# EAGLE design untitled-pan (EAGLE 6.4)
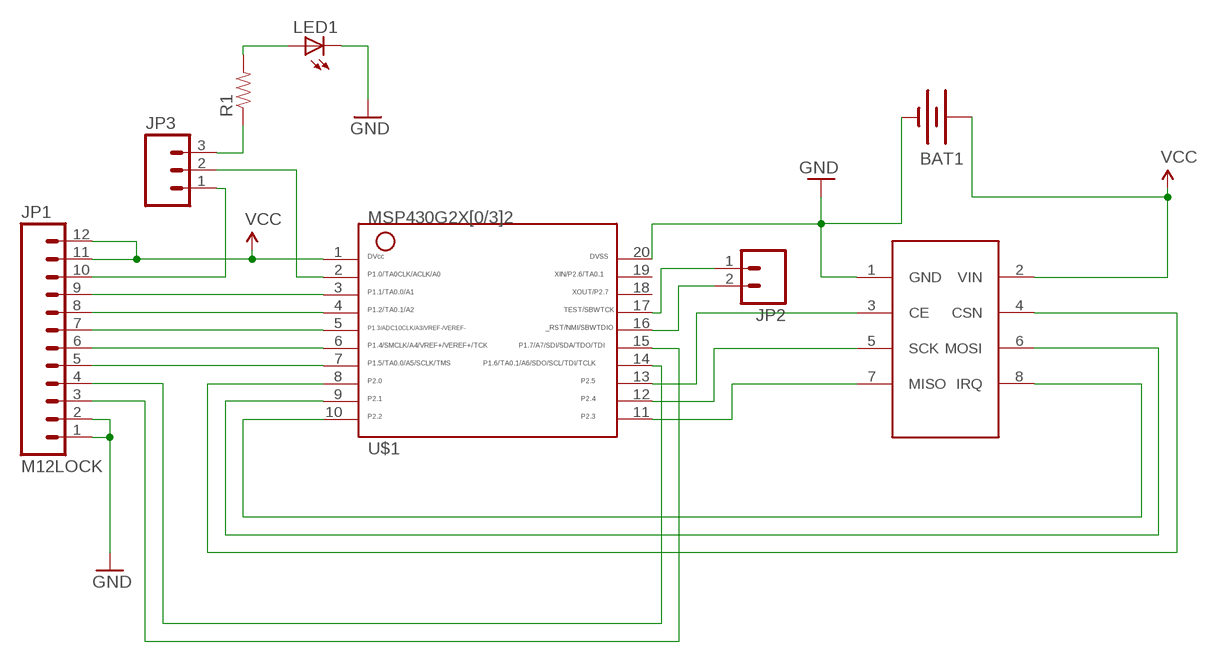
[diagram p0: schematic, sheet 1]

## Parts
BAT1  BATTERY20PTH  [BATTCOM_20MM_PTH]
JP1  M12LOCK  [1X12_LOCK]
JP2  M02PTH  [1X02]
JP3  M03PTH  [1X03]
LED1  LED3MM  [LED3MM]
R1  RESISTORAXIAL-0.3  [AXIAL-0.3]
U1  NRF24L01-4X2  [NRF24L01-4X2]
U$1  G2X[0/3]2---N20  [N20]

## Nets
GND: BAT1.2(-) JP1.1 JP1.2 LED1.K(C) U1.1(GND) U$1.20
N$1: U1.3(CE) U$1.13
N$2: U1.8(IRQ) U$1.10
N$3: U1.7(MISO) U$1.11
N$4: U1.5(SCK) U$1.12
N$5: JP1.4 U$1.14
N$6: JP1.3 U$1.15
N$7: JP1.6 U$1.6
N$8: JP1.7 U$1.5
N$9: JP1.8 U$1.4
N$10: JP1.9 U$1.3
N$11: JP3.2 U$1.2
N$12: JP1.5 U$1.7
N$13: JP2.2 U$1.16
N$14: JP2.1 U$1.17
N$15: JP3.3 R1.P$1
N$16: JP1.10 JP3.1
N$17: U1.6(MOSI) U$1.9
N$18: U1.4(CSN) U$1.8
N$19: LED1.A R1.P$2
VCC: BAT1.1(+) JP1.11 JP1.12 U1.2(VIN) U$1.1
Unconnected: U$1.18 U$1.19

## Library data of the parts
BAT1 = SparkFun-Electromechanical:BATTERY: Battery Holders Various common sizes : AA, AAA, 20mm coin cell and 12mm coin cell. 20MM_4LEGS, BATT-10373
JP1 = SparkFun-Connectors:M12: Header 12 Standard 12-pin 0.1" header. Use with straight break away headers (SKU : PRT-00116), right angle break away headers (PRT-00553), swiss pins (PRT-00743), machine pins (PRT-00117), and female headers (PRT-00115).
JP2 = SparkFun-Connectors:M02: Header 2 Standard 2-pin 0.1" header. Use with straight break away headers (SKU : PRT-00116), right angle break away headers (PRT-00553), swiss pins (PRT-00743), machine pins (PRT-00117), and female headers (PRT-00115). Molex polarized connector foot print use with SKU : PRT-08233 with associated crimp pins and housings.
JP3 = SparkFun-Connectors:M03: Header 3 Standard 3-pin 0.1" header. Use with straight break away headers (SKU : PRT-00116), right angle break away headers (PRT-00553), swiss pins (PRT-00743), machine pins (PRT-00117), and female headers (PRT-00115). Molex polarized connector foot print use with SKU : PRT-08232 with associated crimp pins and housings.
LED1 = SparkFun-LED:LED: LEDs Standard schematic elements and footprints for 5mm, 3mm, 1206, and 0603 sized LEDs. 5mm - Spark Fun Electronics SKU : COM-00529 (and others)
R1 = SparkFun-Passives:RESISTOR: Resistor Basic schematic elements and footprints for 0603, 1206, and PTH resistors.
U1 = untitled:NRF24L01-4X2
U$1 = TI_MSP430_v16:G2X[0/3]2---N20: MSP430G2X[0/3]2 MSP430G2x32, MSP430G2x02 PDIP (N) 20 Pin Package http://focus.ti.com/docs/prod/folders/print/msp430g2432.html

## Board
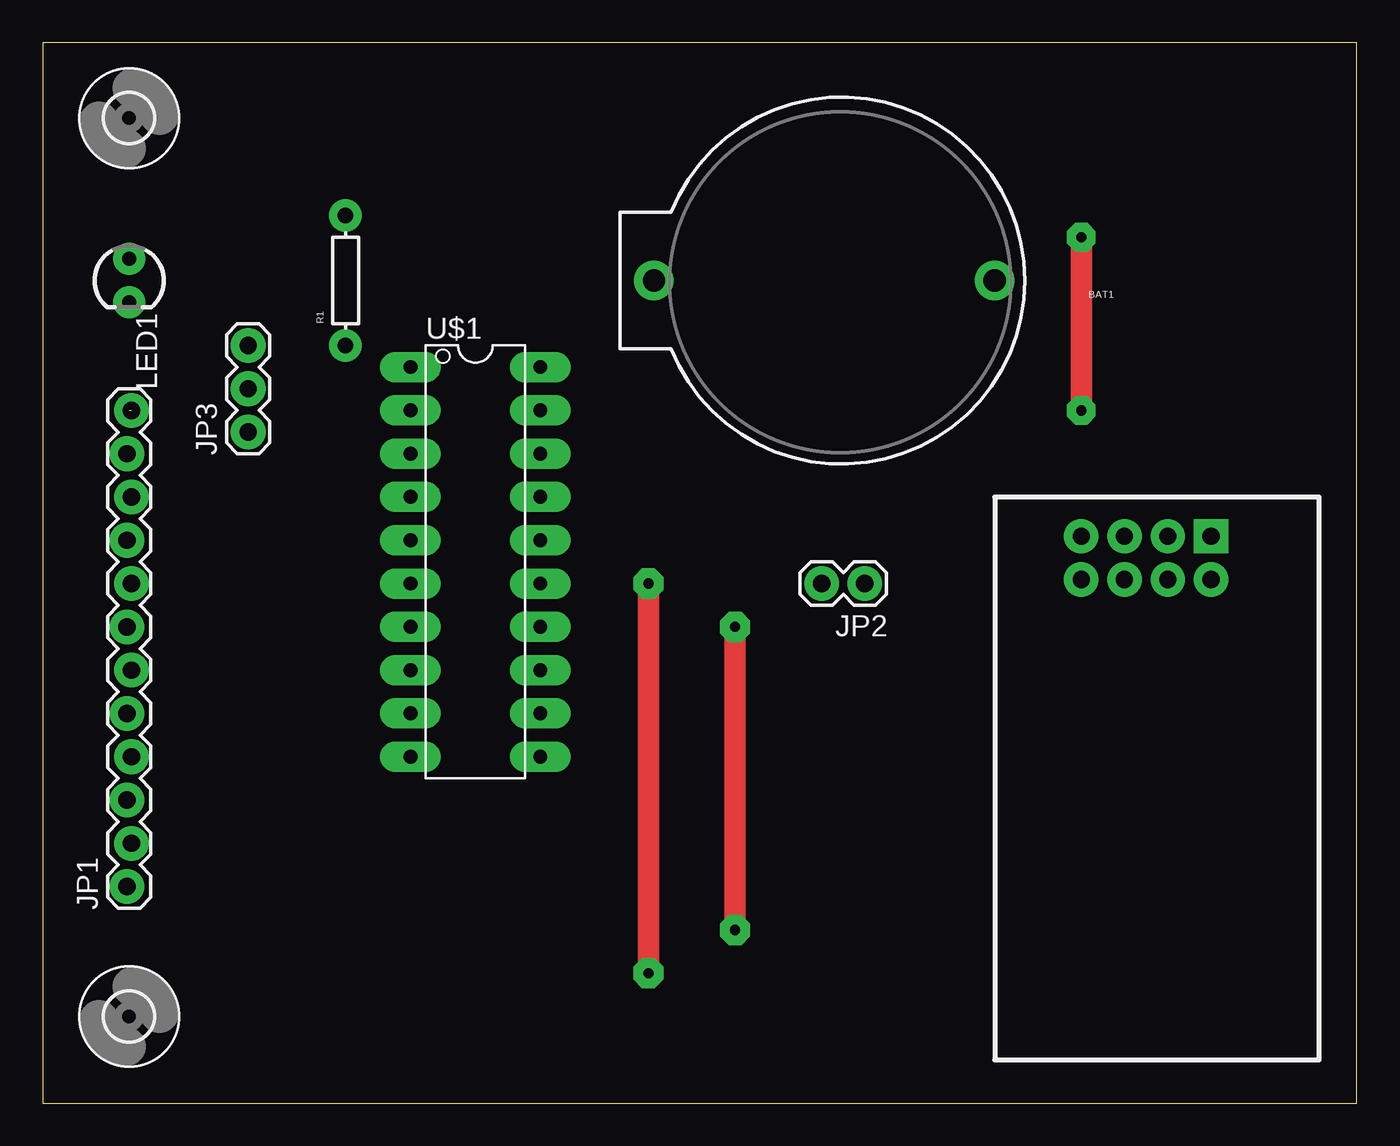
[diagram p1: board, top side]
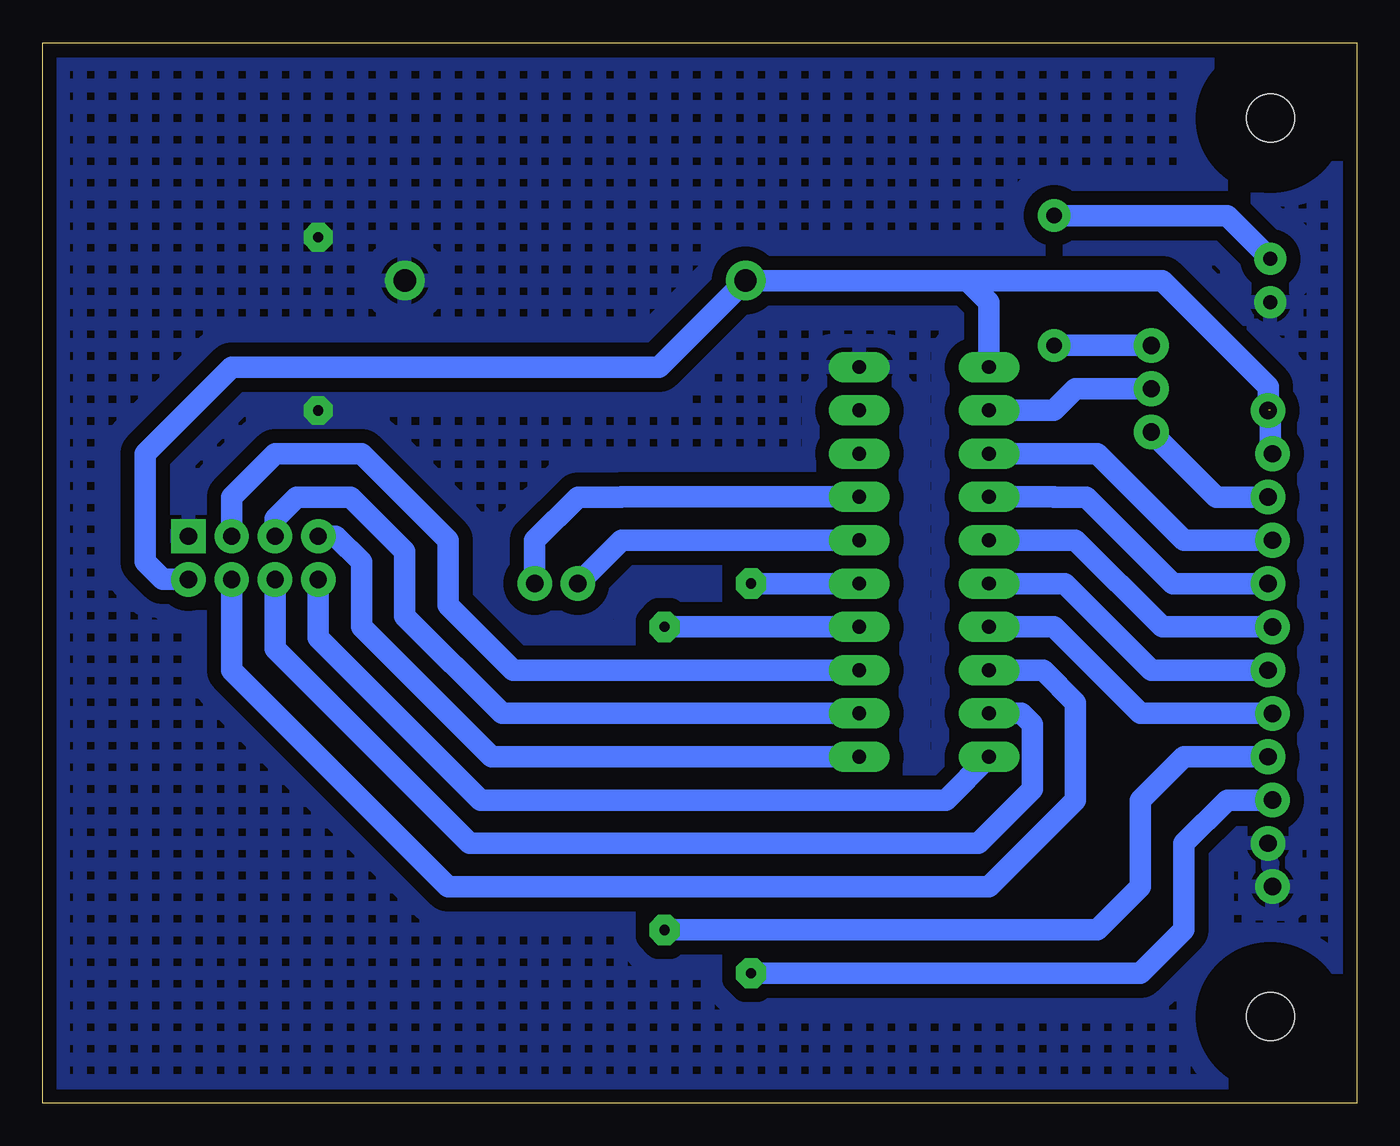
[diagram p2: board, bottom side, seen from below]

Size 77.14 x 62.22 mm. Coordinates in mm from the lower left corner, seen from the top.
Outline: 0,0 77.14,0 77.14,62.22 0,62.22 0,0
Copper layers (1*16): Top 0.035mm / dielectric 1.5mm / Bottom 0.035mm
Design rules "SparkFun *": minimum track width 8mil, minimum drill 20mil, track to track 8mil, track to pad 8mil, pad to pad 8mil, via to via 8mil, smd to smd 8mil, copper to edge 10mil, drill to drill 8mil, minimum pad ring 12mil, minimum via ring 10mil, stop-mask expansion 4mil, vias tented up to drill 25mil, thermal gap 10mil

### Footprints (pad centres in the part's own frame; a part is rotated, then mirrored left to right if it is on the bottom)
BATTCOM_20MM_PTH = drill 1.3: 1 20,0; 2 0,0
1X12_LOCK = drill 1.016 pad 1.88: 1 0,0.127; 2 2.54,-0.127; 3 5.08,0.127; 4 7.62,-0.127; 5 10.16,0.127; 6 12.7,-0.127; 7 15.24,0.127; 8 17.78,-0.127; 9 20.32,0.127; 10 22.86,-0.127; 11 25.4,0.127; 12 27.94,-0.127
1X02 = drill 1.016 pad 1.88: 1 0,0; 2 2.54,0
1X03 = drill 1.016 pad 1.88: 1 0,0; 2 2.54,0; 3 5.08,0
LED3MM = drill 0.813 pad 1.88: A -1.27,0; K 1.27,0
AXIAL-0.3 = drill 0.9 pad 1.88: P$1 -3.81,0; P$2 3.81,0
NRF24L01-4X2 = drill 1 pad 1.778 square: 1 -11.67,3.81 | drill 1 pad 1.778: 2 -9.13,3.81; 3 -11.67,1.27; 4 -9.13,1.27; 5 -11.67,-1.27; 6 -9.13,-1.27; 7 -11.67,-3.81; 8 -9.13,-3.81
N20 = drill 0.813 long: 1 -11.435,-3.81; 2 -8.895,-3.81; 3 -6.355,-3.81; 4 -3.815,-3.81; 5 -1.275,-3.81; 6 1.265,-3.81; 7 3.805,-3.81; 8 6.345,-3.81; 9 8.885,-3.81; 10 11.425,-3.81; 11 11.425,3.81; 12 8.885,3.81; 13 6.345,3.81; 14 3.805,3.81; 15 1.265,3.81; 16 -1.275,3.81; 17 -3.815,3.81; 18 -6.355,3.81; 19 -8.895,3.81; 20 -11.435,3.81
2,8 = hole 2.8: 0,0

### Placement (x,y rotation side)
BAT1  55.88,48.26 180 top
JP1  5.08,12.7 90 top
JP2  48.26,30.48 180 top
JP3  12.06,39.37 90 top
LED1  5.08,48.26 270 top
R1  17.78,48.26 90 top
U1  64.77,21.59 270 top
U$1  25.4,31.75 270 top
U$2  [2,8]  5.08,5.08 0 top
U$5  [2,8]  5.08,57.78 0 top

### Tracks (layer width: path | path; a pad name or v marks a point on that pad's centre or on a via)
GND  (via drill 0.6 pad 1.68)
  Top 1.27: v60.96,40.64 v60.96,50.8
  pour Bottom (isolate 0.813, rank 3, hatched): 76.2,60.96 0,60.96 0,0 76.2,0
N$1
  Bottom 0.406: U$1.13
  Bottom 1.27: U1.3 66.04,35.56 63.5,38.1 58.42,38.1 53.34,33.02 53.34,29.21 49.53,25.4 U$1.13
N$2
  Bottom 1.27: U$1.10 24.14,17.78 51.44,17.78 60.96,27.3 U1.8
N$3
  Bottom 0.406: U$1.11
  Bottom 1.27: U$1.11 50.8,20.32 58.42,27.94 58.42,31.75 59.93,33.26 U1.7
N$4
  Bottom 1.27: U$1.12 43.17,22.86 43.18,22.86 50.16,22.86 55.88,28.57 55.88,32.38 59.05,35.56 62.23,35.56 63.5,34.29 U1.5
N$5  (via drill 0.6 pad 1.78)
  Top 1.27: v40.64,27.94 v40.64,10.16
  Bottom 1.27: U$1.14 v40.63,27.95 v40.64,27.94 | v40.64,10.16 15.24,10.16 12.7,12.7 12.7,17.78 10.16,20.32 JP1.4
N$6  (via drill 0.6 pad 1.78)
  Top 1.27: v35.56,30.48 v35.56,7.62
  Bottom 1.27: v35.56,30.48 v35.55,30.48 U$1.15 | v35.56,7.62 12.7,7.62 10.16,10.16 10.16,15.24 7.62,17.78 JP1.3
N$7
  Bottom 1.27: U$1.6 17.79,30.48 17.78,30.48 17.14,30.48 12.06,25.4 JP1.6
N$8
  Bottom 0.406: U$1.5
  Bottom 1.27: U$1.5 17.79,33.02 17.78,33.02 16.51,33.02 11.43,27.94 JP1.7
N$9
  Bottom 1.27: U$1.4 17.79,35.56 17.78,35.56 15.88,35.56 10.79,30.48 JP1.8
N$10
  Bottom 1.27: U$1.3 17.79,38.1 17.78,38.1 15.24,38.1 10.16,33.02 JP1.9
N$11
  Bottom 1.27: U$1.2 17.78,40.64 16.51,41.91 JP3.2
N$12
  Bottom 0.406: U$1.7
  Bottom 1.27: JP1.5 12.7,22.86 17.79,27.95 U$1.7
N$13
  Bottom 1.27: U$1.16 43.17,33.02 JP2.2
N$14
  Bottom 1.27: U$1.17 43.17,35.56 43.18,35.56 45.72,35.56 48.26,33.02 JP2.1
N$15
  Bottom 1.27: JP3.3 R1.P$1
N$16
  Bottom 1.27: JP3.1 8.26,35.56 JP1.10
N$17
  Bottom 1.27: U$1.9 19.69,22.86 19.05,22.23 19.05,18.41 22.23,15.24 52.07,15.24 63.5,26.67 U1.6
N$18
  Bottom 1.27: U1.4 66.04,25.4 53.34,12.7 21.59,12.7 16.51,17.78 16.51,23.5 18.41,25.4 U$1.8
N$19
  Bottom 1.27: R1.P$2 7.62,52.07 LED1.A
VCC  (1 unrouted)
  Bottom 0.406: U$1.1
  Bottom 1.27: JP1.11 5.08,38.23 5.08,40.64 | 22.86,48.26 11.43,48.26 5.21,42.04 JP1.12 | 22.86,48.26 BAT1.1 40.96,43.18 66.04,43.18 71.12,38.1 71.12,31.75 70.09,30.72 U1.2 | U$1.1 21.59,46.99 22.86,48.26

### Text on the board
_tNames: R1